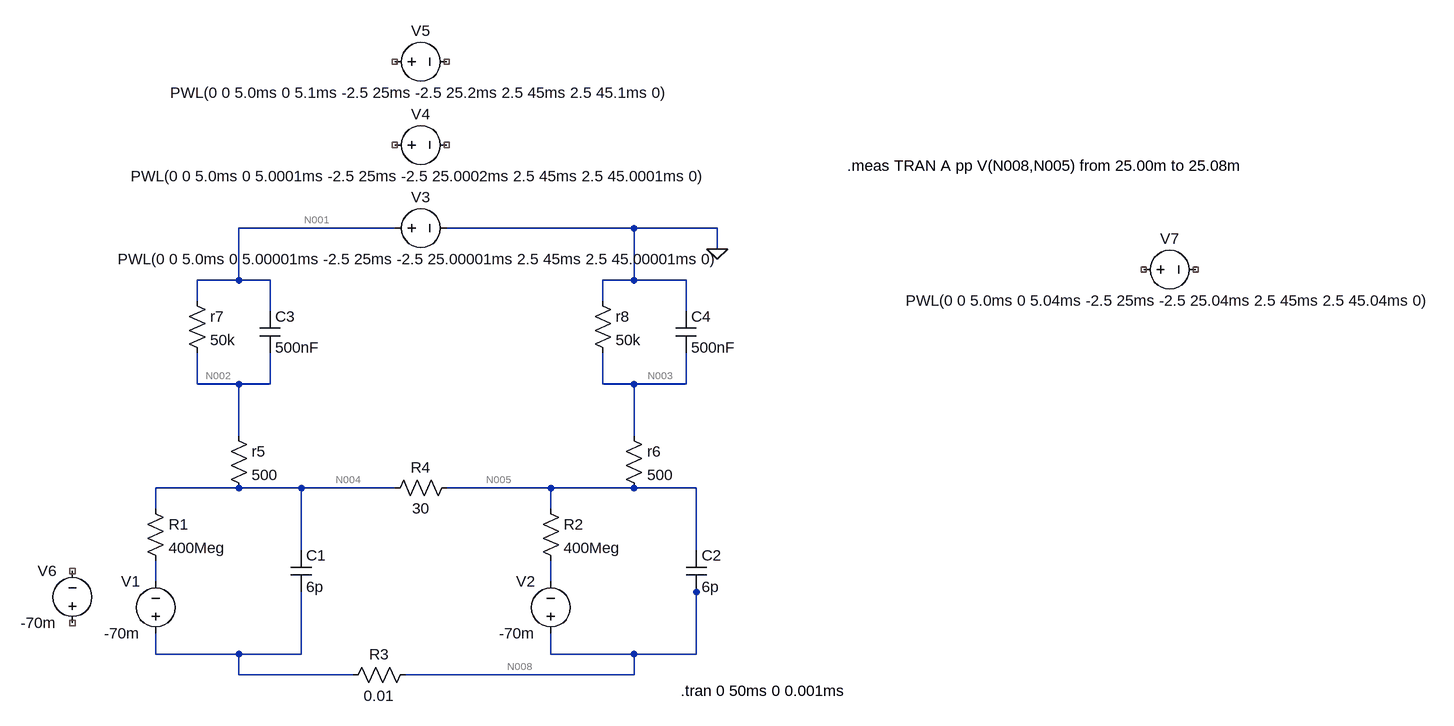
[diagram p0: schematic 電圧刺激等価回路_論文用_20201210_傾き.asc]
* 電圧刺激等価回路_論文用_20201210_傾き.asc
R1 N004 N006 400Meg
R2 N005 N007 400Meg
R3 N008 N009 0.01
r5 N002 N004 500
r6 N003 N005 500
C1 N004 N009 6p
C2 N005 N008 6p
C3 N001 N002 500nF
C4 0 N003 500nF
r7 N001 N002 50k
r8 0 N003 50k
V1 N009 N006 -70m
V2 N008 N007 -70m
R4 N005 N004 30
V5 NC_01 NC_02 PWL(0 0 5.0ms 0 5.1ms -2.5 25ms -2.5 25.2ms 2.5 45ms 2.5 45.1ms 0)
V4 NC_03 NC_04 PWL(0 0 5.0ms 0 5.0001ms -2.5 25ms -2.5 25.0002ms 2.5 45ms 2.5 45.0001ms 0)
V6 NC_05 NC_06 -70m
V7 NC_07 NC_08 PWL(0 0 5.0ms 0 5.04ms -2.5 25ms -2.5 25.04ms 2.5 45ms 2.5 45.04ms 0)
V3 N001 0 PWL(0 0 5.0ms 0 5.00001ms -2.5 25ms -2.5 25.00001ms 2.5 45ms 2.5 45.00001ms 0)
.tran 0 50ms 0 0.001ms
.meas TRAN A pp V(N008,N005) from 25.00m to 25.08m
.backanno
.end

* Results of the author's LTspice run, read from the files saved beside the schematic
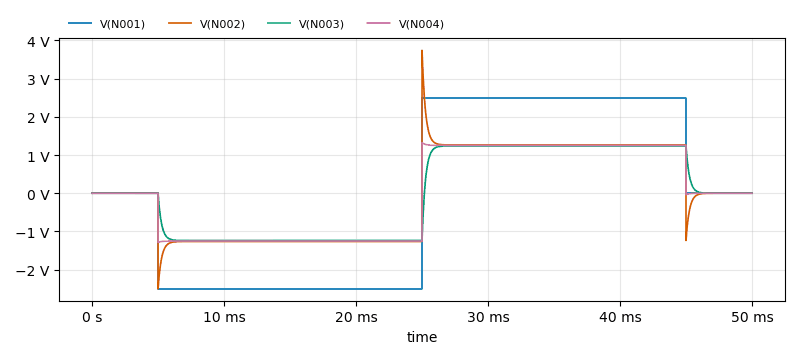
[diagram p1: Transient Analysis of 電圧刺激等価回路_論文用_20201210_傾き.asc, plotted from the saved traces]
* Transient Analysis, 1 run:
*   V(N001): min -2.5 V, max 2.5 V, average 0 V, rms 2.236 V, last 0 V
*   V(N002): min -2.5 V, max 3.737 V, average -25.65 µV, rms 1.161 V, last 0 V
*   V(N003): min -1.237 V, max 1.237 V, average 25.65 µV, rms 1.096 V, last 0 V
*   V(N004): min -1.286 V, max 1.322 V, average -747 nV, rms 1.119 V, last 0 V
* From the log:
*   a: PP(v(n008,n005))=0.072814 FROM 0.025 TO 0.02508